# EasyEDA Pro project 氢气传感器（已标定模块）.eprj

# Schematic Schematic1

## Sheets
1 P1: Board Name: Board1; Create Date: 2025-02-25; Page Name: P1; Project Name: 氢气传感器（已标定模块）; Schematic Name: Schematic1; Update Date: 2025-02-26; Company: 嘉立创EDA; Page Size: A4; Version: V1.0
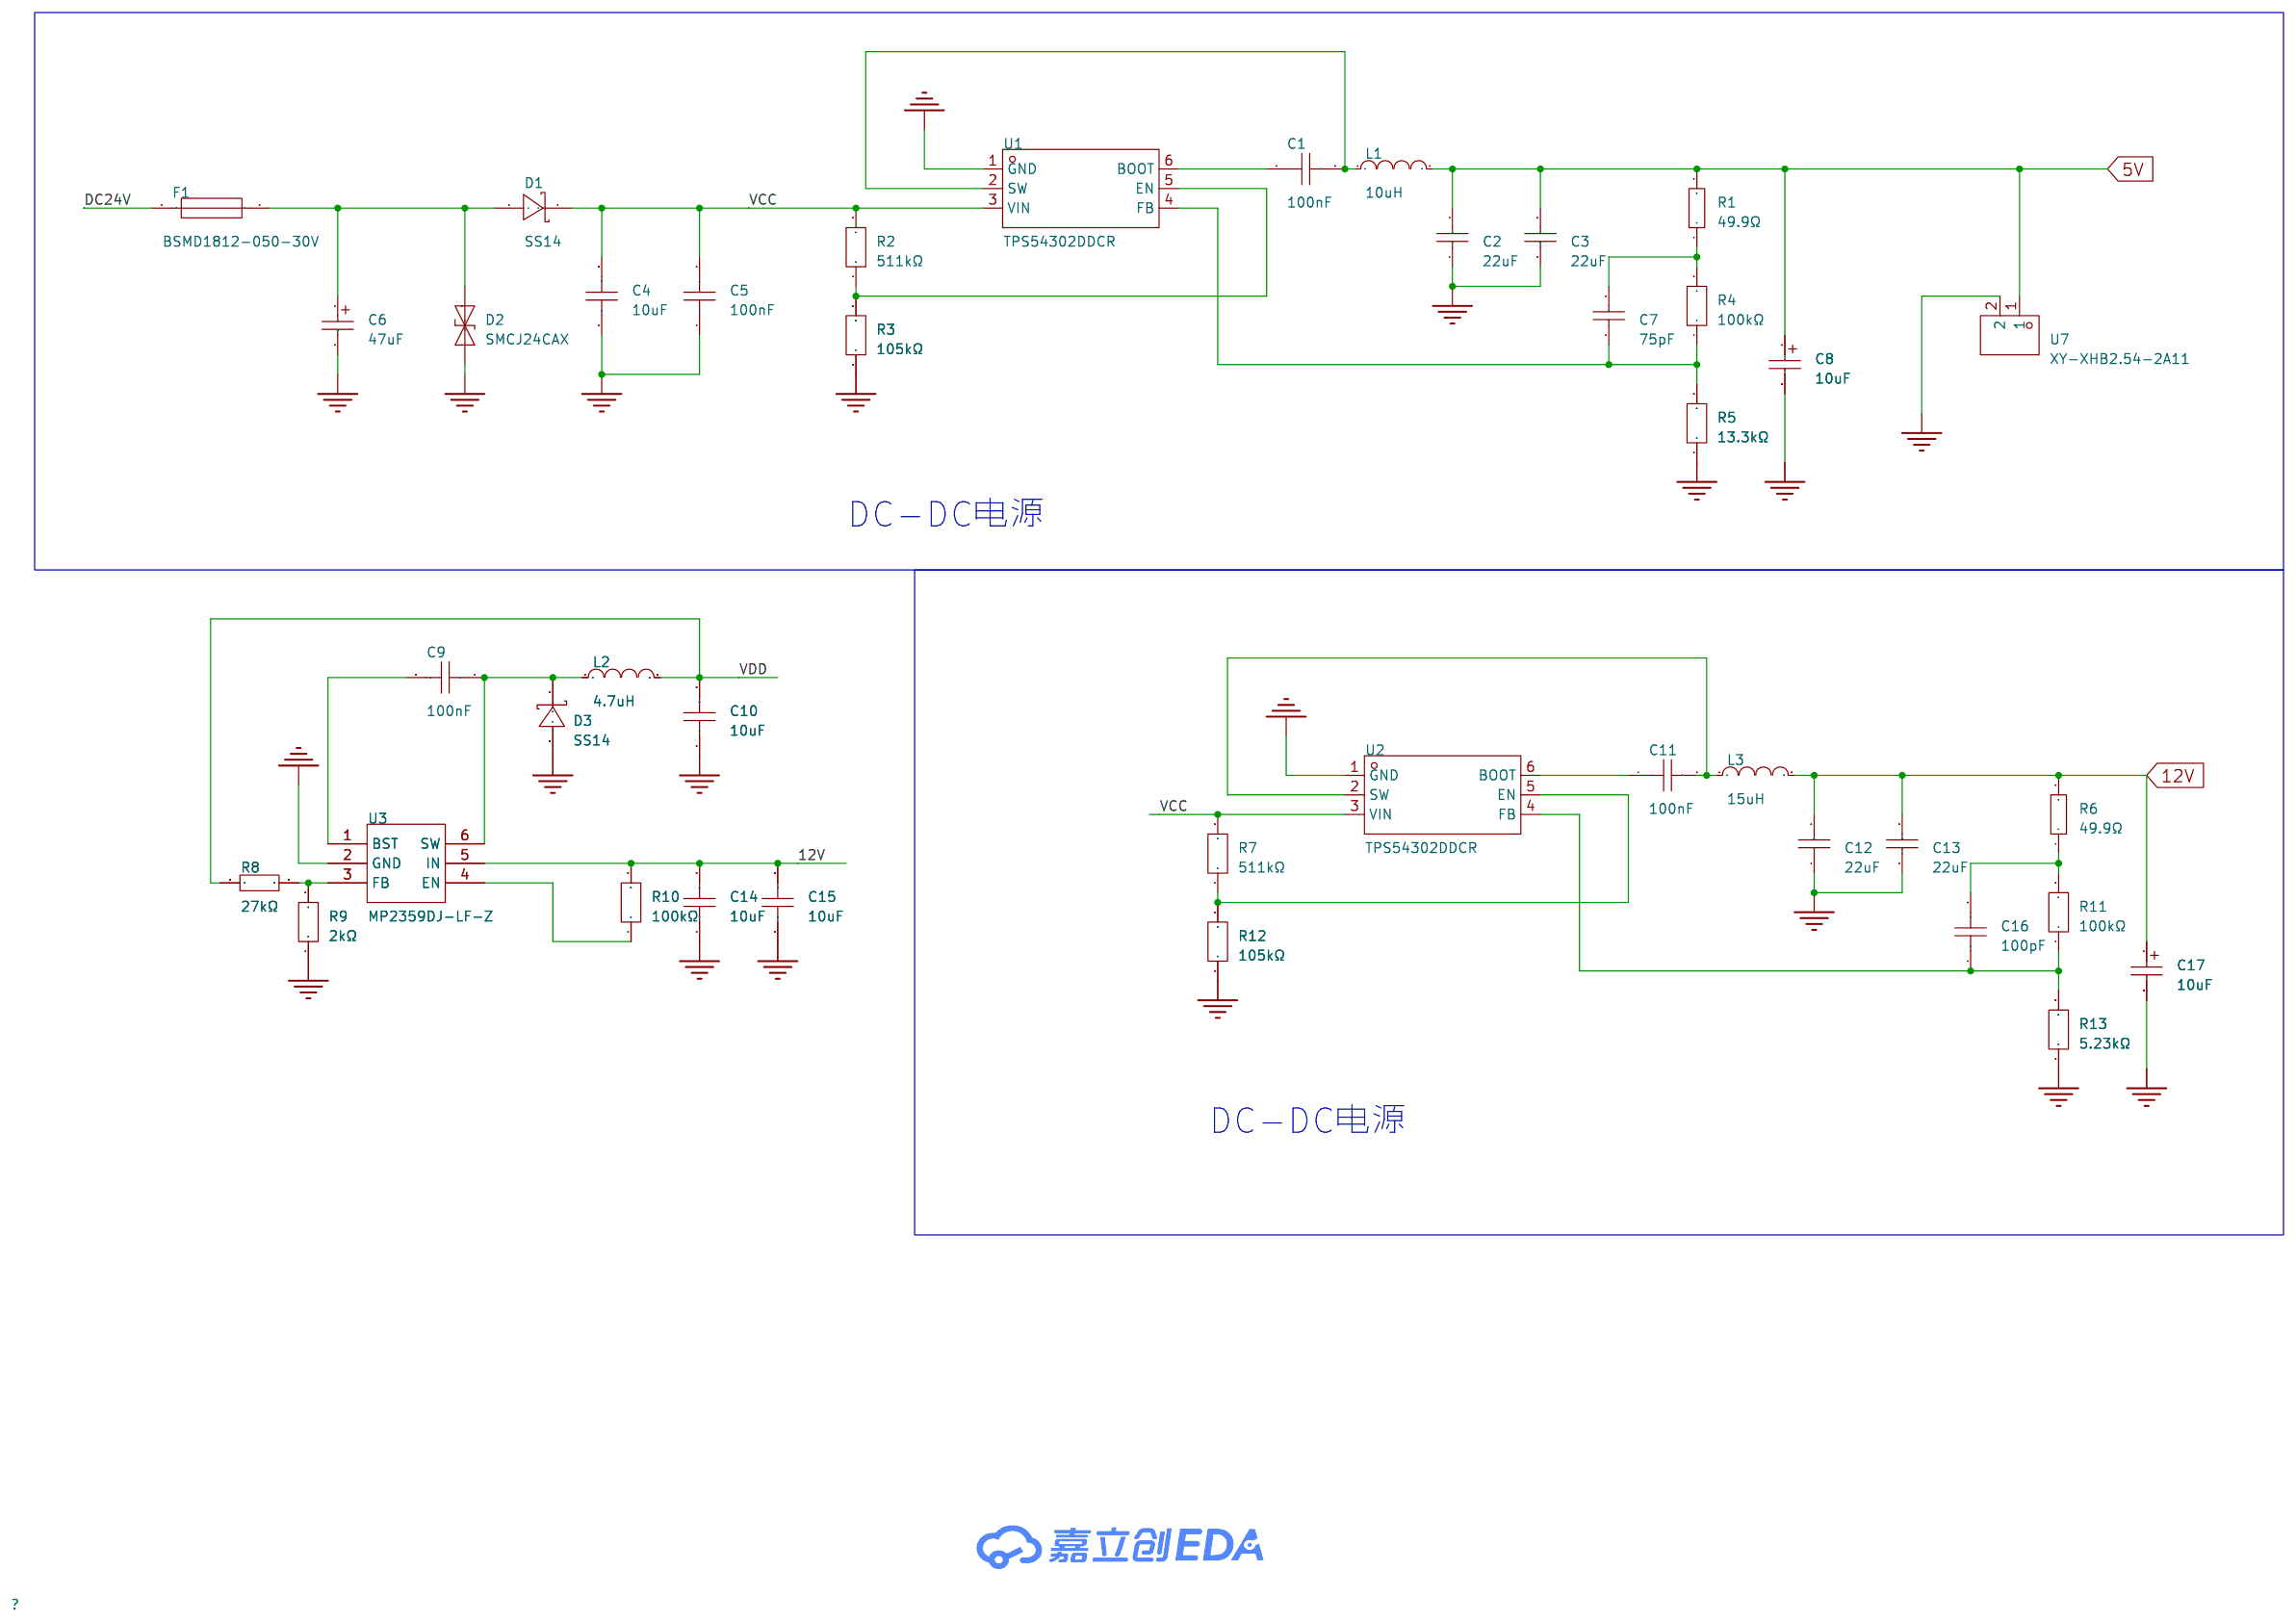
[diagram p0: P1]
2 P2: Page Name: P2; Update Date: 2025-02-27
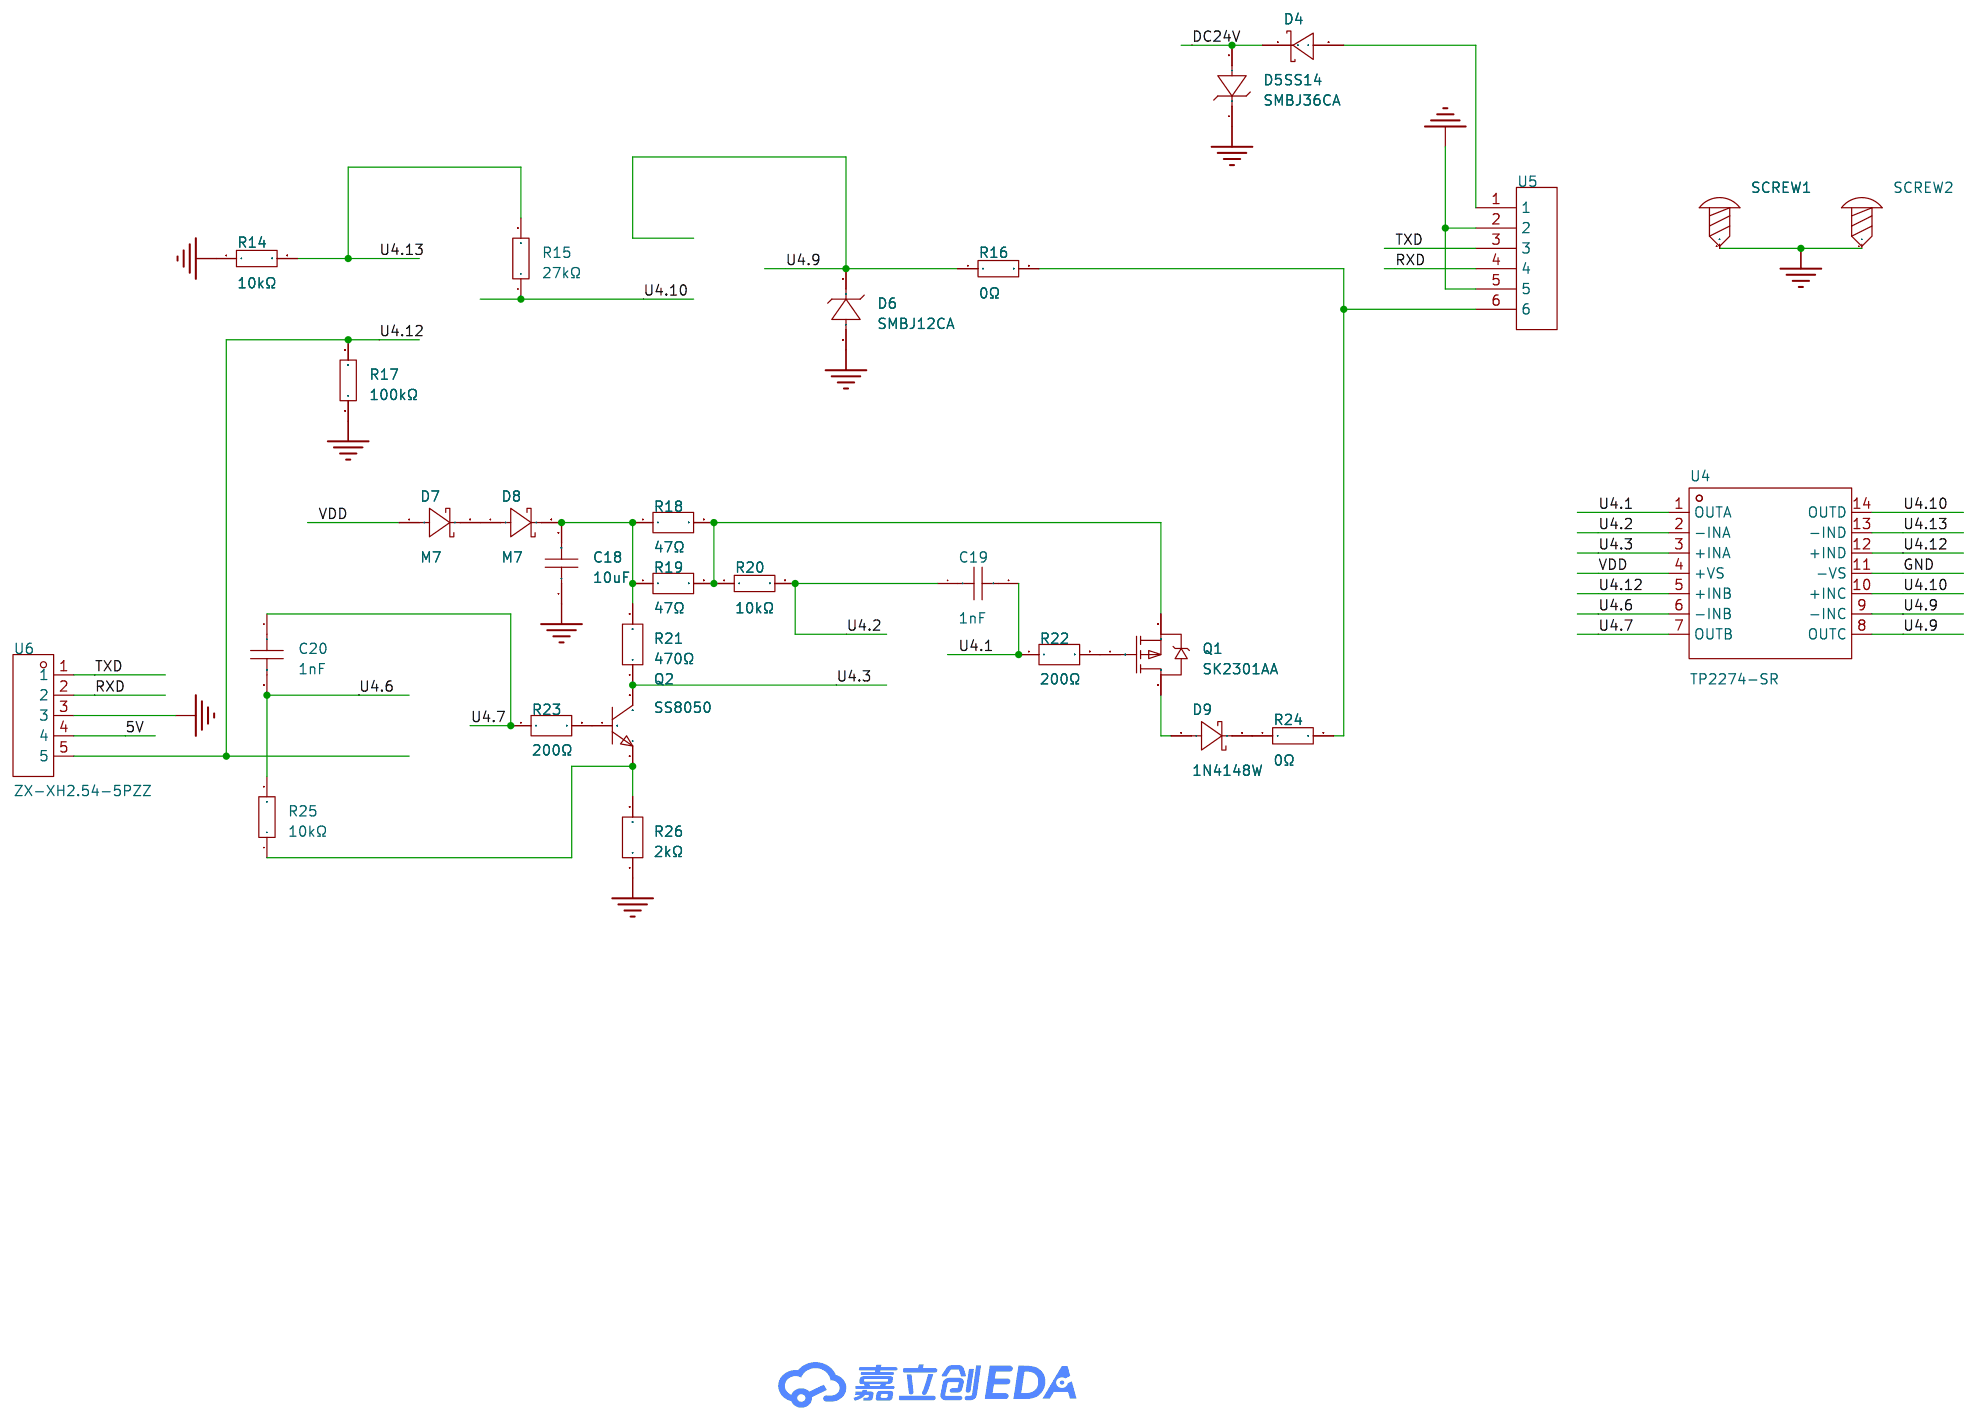
[diagram p1: P2]

## Parts
sheet P1
C1  100nF  [C0402]
C2  22uF  [C0805]
C3  22uF  [C0805]
C4  10uF  [C0603]
C5  100nF  [C0402]
C6  47uF  [CAP-SMD_L7.3-W4.3-FD]
C7  75pF  [C0402]
C8  10uF  [CASE-C_6032]
C9  100nF  [C0402]
C10  10uF  [C0603]
C11  100nF  [C0402]
C12  22uF  [C0805]
C13  22uF  [C0805]
C14  10uF  [C0603]
C15  10uF  [C0603]
C16  100pF  [C0402]
C17  10uF  [CASE-C_6032]
D1  SS14  [SMA_L4.2-W2.6-LS5.3-RD]
D2  SMCJ24CAX  [SMC_L6.9-W5.9-LS7.9-BI]
D3  SS14  [SMA_L4.3-W2.6-LS5.2-RD]
F1  BSMD1812-050-30V  [F1812]
L1  10uH  [IND-SMD_L4.4-W4.2]
L2  4.7uH  [IND-SMD_L7.0-W6.6]
L3  15uH  [IND-SMD_L4.0-W4.0]
R1  49.9Ω  [R0402]
R2  511kΩ  [R0603]
R3  105kΩ  [R0402]
R4  100kΩ  [R0402]
R5  13.3kΩ  [R0603]
R6  49.9Ω  [R0402]
R7  511kΩ  [R0603]
R8  27kΩ  [R0603]
R9  2kΩ  [R0603]
R10  100kΩ  [R0402]
R11  100kΩ  [R0402]
R12  105kΩ  [R0402]
R13  5.23kΩ  [R0603]
U1  TPS54302DDCR  [SOT-23-6_L2.9-W1.6-P0.95-LS2.8-BL]
U2  TPS54302DDCR  [SOT-23-6_L2.9-W1.6-P0.95-LS2.8-BL]
U3  MP2359DJ-LF-Z  [SOT-23-6_L2.9-W1.6-P0.95-LS2.8-BR]
U7  XY-XHB2.54-2A11  [HDR-TH_2P-P2.50-V-F-1]
sheet P2
C18  10uF  [C0603]
C19  1nF  [C0603]
C20  1nF  [C0603]
D4  SS14  [SMA_L4.3-W2.6-LS5.2-RD]
D5  SMBJ36CA  [SMB_L4.6-W3.6-LS5.4-RD]
D6  SMBJ12CA  [SMB_L4.6-W3.6-LS5.4-RD]
D7  M7  [SMA_L4.3-W2.6-LS5.0-FD]
D8  M7  [SMA_L4.3-W2.6-LS5.0-FD]
D9  1N4148W  [SOD-123_L2.7-W1.6-LS3.7-FD]
Q1  SK2301AA  [SOT-23-3_L2.9-W1.6-P1.90-LS2.8-BR]
Q2  SS8050  [SOT-23-3_L2.9-W1.3-P1.90-LS2.4-BR]
R14  10kΩ  [R0603]
R15  27kΩ  [R0603]
R16  0Ω  [R0603]
R17  100kΩ  [R0603]
R18  47Ω  [R0603]
R19  47Ω  [R0603]
R20  10kΩ  [R0603]
R21  470Ω  [R0603]
R22  200Ω  [R0603]
R23  200Ω  [R0603]
R24  0Ω  [R0603]
R25  10kΩ  [R0603]
R26  2kΩ  [R0603]
SCREW1  -  [M4螺丝]
SCREW2  -  [M4螺丝]
U4  TP2274-SR  [SOIC-14_L8.7-W3.9-P1.27-LS6.0-BL]
U5  -  [LC8+LZ8V-2.54 5PIN]
U6  ZX-XH2.54-5PZZ  [CONN-TH_5P-P2.50_ZX-XH2.54-5PZZ]

## Library data of the parts
C1 C5 C9 C11 = CC0402KRX7R9BB104: LCSC Part Name: 100nF ±10% 50V; Supplier Part: C131394; Manufacturer: YAGEO(国巨); Supplier Footprint: 0402; JLCPCB Part Class: Extended Part; Datasheet: https://atta.szlcsc.com/upload/public/pdf/source/20181008/C309510_22F155564471FAF6A489F7D68F34234E.pdf; Supplier: LCSC; Tolerance: ±10%; Voltage Rated: 50V; Temperature Coefficient: X7R
C2 C3 C12 C13 = CC0805MKX5R8BB226: 容值:22uF;精度:±20%;额定电压:25V;材质(温度系数):X5R;; LCSC Part Name: 22uF ±20% 25V; Supplier Part: C784585; Manufacturer: YAGEO(国巨); Supplier Footprint: 0805; JLCPCB Part Class: 扩展库; Datasheet: https://atta.szlcsc.com/upload/public/pdf/source/20200508/C527238_0EA038105174A9B3D7C24FF11EEA8EC7.pdf; Supplier: LCSC; Tolerance: ±20%; Voltage Rated: 25V; Temperature Coefficient: X5R
C4 C10 C14 C15 = GRM188R6YA106MA73D: 容值:10uF;精度:±20%;额定电压:35V;材质(温度系数):X5R;; LCSC Part Name: 10uF ±20% 35V; Supplier Part: C194427; Manufacturer: muRata(村田); Supplier Footprint: 0603; JLCPCB Part Class: Extended Part; Datasheet: https://atta.szlcsc.com/upload/public/pdf/source/20210128/C194427_FCA3640823207DDB58700A82F1A19B5F.pdf; Supplier: LCSC; Tolerance: ±20%; Voltage Rated: 35V; Temperature Coefficient: X5R
C6 = T491X476K035AT: 容值:47uF;精度:±10%;额定电压:35V;等效串联电阻:600mΩ@100kHz;; LCSC Part Name: 47uF ±10% 35V; Supplier Part: C87110; Manufacturer: KEMET(基美); Supplier Footprint: CASE-X-7343; JLCPCB Part Class: 扩展库; Datasheet: https://atta.szlcsc.com/upload/public/pdf/source/20190402/C118128_17DC26F5D7668F0165447CB640F1E367.pdf; Supplier: LCSC; Tolerance: ±10%; Rated Voltage: 35V; Equivalent Series Resistance(ESR): 600mΩ@100kHz; Operating Temperature: -55℃~+125℃
C7 = CC0402JRNPO9BN750: 容值:75pF;精度:±5%;额定电压:50V;材质(温度系数):NP0;; LCSC Part Name: 75pF ±5% 50V; Supplier Part: C107010; Manufacturer: YAGEO(国巨); Supplier Footprint: 0402; JLCPCB Part Class: Extended Part; Datasheet: https://atta.szlcsc.com/upload/public/pdf/source/20170914/C128857_1505359892143968080.pdf; Supplier: LCSC; Tolerance: ±5%; Voltage Rated: 50V; Temperature Coefficient: NP0
C8 C17 = TAJC106K035RNJ: 容值:10uF;精度:±10%;额定电压:35V;等效串联电阻:1.6Ω@100kHz;; LCSC Part Name: 10uF ±10% 35V; Supplier Part: C7211; Manufacturer: Kyocera AVX; Supplier Footprint: CASE-C-6032; JLCPCB Part Class: 扩展库; Datasheet: https://atta.szlcsc.com/upload/public/pdf/source/20160107/1457707750344.pdf; Supplier: LCSC; Tolerance: ±10%; Rated Voltage: 35V; Equivalent Series Resistance(ESR): 1.6Ω@100kHz; Operating Temperature: -55℃~+125℃
C16 = CC0402KRX7R8BB101: 容值:100pF;精度:±10%;额定电压:25V;材质(温度系数):X7R;; LCSC Part Name: 100pF ±10% 25V; Supplier Part: C541383; Manufacturer: YAGEO(国巨); Supplier Footprint: 0402; JLCPCB Part Class: 扩展库; Datasheet: https://atta.szlcsc.com/upload/public/pdf/source/20200615/C541383_DECF9DA0F3ABF65B608AAC96DDEE57A4.pdf; Supplier: LCSC; Tolerance: ±10%; Voltage Rated: 25V; Temperature Coefficient: X7R
D1 = SS14_C2480: 二极管配置:独立式;正向压降(Vf):550mV@1A;直流反向耐压(Vr):40V;整流电流:1A;; LCSC Part Name: 电压:40V 电流:1A; Supplier Part: C2480; Manufacturer: MDD(辰达半导体); Supplier Footprint: SMA(DO-214AC); JLCPCB Part Class: 基础库; Datasheet: https://atta.szlcsc.com/upload/public/pdf/source/20240710/EF24798823EE33D63F154ED67BAC5E71.pdf; Supplier: LCSC; Diode Configuration: 独立式; Forward Voltage (Vf@If): 550mV@1A; Reverse Voltage (Vr): 40V; Rectified Current: 1A; Reverse Leakage Current (Ir): 300uA@40V
D2 = SMCJ24CAX: VRWM24(V)/VBR(Min)@IT26.7(V)/VBR(Max)@IT30.7(V)/IT1(mA)/IR5(uA)/VC(Max)38.9(V)/Ipp(Max)38.6(A); LCSC Part Name: SMCJ24CA; Supplier Part: C3038088; Manufacturer: 晶扬电子; Supplier Footprint: SMC; JLCPCB Part Class: 扩展库; Datasheet: https://atta.szlcsc.com/upload/public/pdf/source/20220706/E11633D1F3056EEAC21E697B7AB2FD4F.pdf; Supplier: LCSC
D3 D4 = SS14_C83852: LCSC Part Name: 电压:40V 电流:1A; Supplier Part: C83852; Manufacturer: onsemi(安森美); Supplier Footprint: SMA(DO-214AC); JLCPCB Part Class: 扩展库; Datasheet: https://atta.szlcsc.com/upload/public/pdf/source/20181222/C83852_041FE29A925F1DAA7D9CB1F1C69076C2.pdf; Supplier: LCSC; Forward Voltage (Vf@If): 500mV@1A; Reverse Voltage (Vr): 40V; Rectified Current: 1A; Reverse Leakage Current (Ir): 200uA@40V
F1 = BSMD1812-050-30V: 最大电压:30V;最大电流:40A;保持电流:500mA;跳闸电流:1A;; LCSC Part Name: 30V 500mA 1812自恢复; Supplier Part: C883141; Manufacturer: BHFUSE(佰宏); Supplier Footprint: 1812; JLCPCB Part Class: 扩展库; Datasheet: https://atta.szlcsc.com/upload/public/pdf/source/20230512/6ED7FF50F668B3AF958C55F12246A840.pdf; Supplier: LCSC; Operating Voltage (Max): 30V; Current Rating (Max): 40A; Hold Current: 500mA; Trip Current: 1A; Power Dissipation: 800mW; Resistance - Initial (Ri) (Min): 150mΩ; Resistance - Post Trip (R1) (Max): 1.4Ω; Maximum Time to Trip: 150ms; Operating Temperature: -40℃~+85℃
L1 = FXL0420-100-M: 电感值:10uH;精度:±20%;额定电流:1.6A;饱和电流(Isat):2.2A;类型:一体成型电感;; LCSC Part Name: 10uH ±20% 2.2A; Supplier Part: C177242; Manufacturer: cjiang(长江微电); Supplier Footprint: SMD,4.2x4.4mm; JLCPCB Part Class: 扩展库; Datasheet: https://atta.szlcsc.com/upload/public/pdf/source/20240426/3189EA8206330E2108542F9E34E540E7.pdf; Supplier: LCSC; Tolerance: ±20%; Rated Current: 1.6A; Saturation Current (Isat): 2.2A; DC Resistance (DCR): 282mΩ; Type: 一体成型电感
L2 = FXL0630-4R7-M: LCSC Part Name: 4.7uH ±20% 9A; Supplier Part: C167220; Manufacturer: cjiang(长江微电); Supplier Footprint: SMD,6.6x7mm; JLCPCB Part Class: 扩展库; Datasheet: https://atta.szlcsc.com/upload/public/pdf/source/20240426/3189EA8206330E2108542F9E34E540E7.pdf; Supplier: LCSC; Tolerance: ±20%; Rated Current: 6A; Saturation Current (Isat): 9A; DC Resistance (DCR): 33mΩ; Type: 一体成型电感
L3 = FHD4020S-150MT: 电感值:15uH;精度:±20%;额定电流:1.2A;饱和电流(Isat):2.8A;; LCSC Part Name: 15uH ±20% 2.8A; Supplier Part: C602033; Manufacturer: cjiang(长江微电); Supplier Footprint: SMD,4x4mm; JLCPCB Part Class: 扩展库; Datasheet: https://atta.szlcsc.com/upload/public/pdf/source/20200609/C601990_BCEA243EC4DA0A9A288AA78A6DFB48A5.pdf; Supplier: LCSC; Tolerance: ±20%; Rated Current: 1.2A; Saturation Current (Isat): 2.8A; DC Resistance (DCR): 305mΩ
R1 R6 = PTFR0402B49R9P9: 电阻类型:薄膜电阻;阻值:49.9Ω;精度:±0.1%;功率:60mW;最大工作电压:75V;温度系数:±25ppm/℃;; LCSC Part Name: 薄膜电阻 49.9Ω ±0.1% 60mW; Supplier Part: C478876; Manufacturer: RESI(开步睿思); Supplier Footprint: 0402; JLCPCB Part Class: Extended Part; Datasheet: https://atta.szlcsc.com/upload/public/pdf/source/20240506/11BDC7478D84177AC2A5326A65B6EB29.pdf; Supplier: LCSC; Type: 薄膜电阻; Tolerance: ±0.1%; Power(Watts): 60mW; Overload Voltage (Max): 75V; Temperature Coefficient: ±25ppm/℃; Operating Temperature Range: -55℃~+125℃
R2 R7 = ARG03BTC5113: 电阻类型:薄膜电阻;阻值:511kΩ;精度:±0.1%;功率:100mW;最大工作电压:75V;温度系数:±25ppm/℃;; LCSC Part Name: 薄膜电阻 511kΩ ±0.1% 100mW; Supplier Part: C2684557; Manufacturer: Viking(光颉); Supplier Footprint: 0603; JLCPCB Part Class: Extended Part; Datasheet: https://atta.szlcsc.com/upload/public/pdf/source/20200117/C485675_99063924B4564AF910B7BE66DA8EFA49.pdf; Supplier: LCSC; Type: 薄膜电阻; Tolerance: ±0.1%; Power(Watts): 100mW; Overload Voltage (Max): 75V; Temperature Coefficient: ±25ppm/℃; Operating Temperature Range: -55℃~+155℃
R3 R12 = RT0402BRD07105KL: 电阻类型:薄膜电阻;阻值:105kΩ;精度:±0.1%;功率:62.5mW;温度系数:±25ppm/℃;; LCSC Part Name: 薄膜电阻 105kΩ ±0.1% 62.5mW; Supplier Part: C852475; Manufacturer: YAGEO(国巨); Supplier Footprint: 0402; JLCPCB Part Class: Extended Part; Datasheet: https://atta.szlcsc.com/upload/public/pdf/source/20200610/C326738_5639A9F1B6EB6E4AE2197577D3456E7F.pdf; Supplier: LCSC; Type: 薄膜电阻; Tolerance: ±0.1%; Power(Watts): 62.5mW; Temperature Coefficient: ±25ppm/℃; Operating Temperature Range: -55℃~+155℃
R4 R10 R11 = RT0402BRD07100KL: 电阻类型:薄膜电阻;阻值:100kΩ;精度:±0.1%;功率:62.5mW;最大工作电压:50V;温度系数:±25ppm/℃;; LCSC Part Name: 薄膜电阻 100kΩ ±0.1% 62.5mW; Supplier Part: C852472; Manufacturer: YAGEO(国巨); Supplier Footprint: 0402; JLCPCB Part Class: 扩展库; Datasheet: https://atta.szlcsc.com/upload/public/pdf/source/20210326/C852472_6283D268A9C33EA67274729CC55E28B1.pdf; Supplier: LCSC; Type: 薄膜电阻; Tolerance: ±0.1%; Power(Watts): 62.5mW; Overload Voltage (Max): 50V; Temperature Coefficient: ±25ppm/℃; Operating Temperature Range: -55℃~+155℃
R5 = RT0603BRD0713K3L: 电阻类型:薄膜电阻;阻值:13.3kΩ;精度:±0.1%;功率:100mW;最大工作电压:75V;温度系数:±25ppm/℃;; LCSC Part Name: 薄膜电阻 13.3kΩ ±0.1% 100mW; Supplier Part: C861117; Manufacturer: YAGEO(国巨); Supplier Footprint: 0603; JLCPCB Part Class: Extended Part; Datasheet: https://atta.szlcsc.com/upload/public/pdf/source/20200610/C326738_5639A9F1B6EB6E4AE2197577D3456E7F.pdf; Supplier: LCSC; Type: 薄膜电阻; Tolerance: ±0.1%; Power(Watts): 100mW; Overload Voltage (Max): 75V; Temperature Coefficient: ±25ppm/℃; Operating Temperature Range: -55℃~+155℃
R8 R15 = RT0603BRE0727KL: LCSC Part Name: 薄膜电阻 27kΩ ±0.1% 100mW; Supplier Part: C326751; Manufacturer: YAGEO(国巨); Supplier Footprint: 0603; JLCPCB Part Class: Extended Part; Datasheet: https://atta.szlcsc.com/upload/public/pdf/source/20181031/C326751_F0C7ED3CCC78679E2CE8C1AED7A94608.pdf; Supplier: LCSC; Type: 薄膜电阻; Tolerance: ±0.1%; Power(Watts): 100mW; Overload Voltage (Max): 75V; Temperature Coefficient: ±50ppm/℃; Operating Temperature Range: -55℃~+155℃
R9 R26 = RT0603BRD072KL: LCSC Part Name: 薄膜电阻 2kΩ ±0.1% 100mW; Supplier Part: C728588; Manufacturer: YAGEO(国巨); Supplier Footprint: 0603; JLCPCB Part Class: Extended Part; Datasheet: https://atta.szlcsc.com/upload/public/pdf/source/20200814/C723483_9C38DBFE9BAEFED0FBB9716EAA9FF07C.pdf; Supplier: LCSC; Type: 薄膜电阻; Tolerance: ±0.1%; Power(Watts): 100mW; Temperature Coefficient: ±25ppm/℃; Operating Temperature Range: -55℃~+155℃
R13 = RT0603BRD075K23L: 电阻类型:薄膜电阻;阻值:5.23kΩ;精度:±0.1%;功率:100mW;温度系数:±25ppm/℃;; LCSC Part Name: 薄膜电阻 5.23kΩ ±0.1% 100mW; Supplier Part: C861485; Manufacturer: YAGEO(国巨); Supplier Footprint: 0603; JLCPCB Part Class: Extended Part; Datasheet: https://atta.szlcsc.com/upload/public/pdf/source/20200610/C326738_5639A9F1B6EB6E4AE2197577D3456E7F.pdf; Supplier: LCSC; Type: 薄膜电阻; Tolerance: ±0.1%; Power(Watts): 100mW; Temperature Coefficient: ±25ppm/℃; Operating Temperature Range: -55℃~+155℃
U1 U2 = TPS54302DDCR: 功能类型:降压型;输出类型:固定;工作电压:4.5V~28V;输出电压:5V;输出电流:3A;; LCSC Part Name: 4.5V至28V输入、3A输出、EMI友好的同步降压转换器; Supplier Part: C311983; Manufacturer: TI(德州仪器); Supplier Footprint: TSOT-23-6; JLCPCB Part Class: 扩展库; Datasheet: https://www.ti.com/cn/lit/gpn/tps54302; Supplier: LCSC; Function: 降压型; Output Type: 固定; Input Voltage: 4.5V~28V; Output Voltage: 5V; Output Current: 3A; Switching Frequency: 400kHz; Operating Temperature: -40℃~+125℃; Synchronous Rectification: 是; Number of Outputs: 1; Topology: 降压式; Quiescent Current (Iq): 45uA; Switch tube (built-in/external): 内置
U3 = MP2359DJ-LF-Z: Supplier Part: C14259; Manufacturer: MPS(芯源); Supplier Footprint: TSOT-23-6; JLCPCB Part Class: 扩展库; Datasheet: https://atta.szlcsc.com/upload/public/pdf/source/20240129/21CBBF6F83E2E7F822A0D20325A1F6D1.pdf; Supplier: LCSC; Function: 降压型; Output Type: 可调; Input Voltage: 4.5V~24V; Output Voltage: 810mV~15V; Output Current: 1.2A; Switching Frequency: 1.4MHz; Operating Temperature: -40℃~+85℃@(TA); Synchronous Rectification: 否; Number of Outputs: 1; Topology: 降压式; Switch tube (built-in/external): 内置
U7 = XY-XHB2.54-2A11: LCSC Part Name: 1x2P 间距:2.54mm 直插; Supplier Part: C19271386; Manufacturer: XYECONN(辛译); Supplier Footprint: 插件,P=2.54mm; JLCPCB Part Class: 扩展库; Datasheet: https://atta.szlcsc.com/upload/public/pdf/source/20231124/C902967B562345BA8733710E2DCD4DF9.pdf; Supplier: LCSC; Pins Structure: 1x2P; Pitch: 2.54mm; Mounting Style: 直插; Number of Pins: 2P; Number of Rows: 1; Number of PINs Per Row: 2; Row Spacing: 2.54mm; Current Rating (Max): 2A; Operating Temperature Range: -25℃~+85℃
C18 = HGC0603R5106M350NTHJ: LCSC Part Name: 10uF ±20% 35V; Supplier Part: C22367827; Manufacturer: Chinocera(华瓷); Supplier Footprint: 0603; JLCPCB Part Class: 扩展库; Datasheet: https://atta.szlcsc.com/upload/public/pdf/source/20240326/08136F0414FFF46DD07E47F2D66E675E.pdf; Supplier: LCSC; Tolerance: ±20%; Voltage Rated: 35V; Temperature Coefficient: X5R
C19 C20 = CC0603KRX7R9BB102: LCSC Part Name: 1nF ±10% 50V; Supplier Part: C100040; Manufacturer: YAGEO(国巨); Supplier Footprint: 0603; JLCPCB Part Class: Extended Part; Datasheet: https://atta.szlcsc.com/upload/public/pdf/source/20180910/C282072_33301C7F631E79921B82A8DAC6BCC5B3.pdf; Supplier: LCSC; Tolerance: ±10%; Voltage Rated: 50V; Temperature Coefficient: X7R
D5 = SMBJ36CA_C19077589: Supplier Part: C19077589; Manufacturer: 宏嘉诚; Supplier Footprint: SMB; JLCPCB Part Class: Extended Part; Datasheet: https://atta.szlcsc.com/upload/public/pdf/source/20250107/474F05451FC8AB27D7FA0238914F96F6.pdf; Supplier: LCSC; Polarity: 双向; Reverse Stand-Off Voltage (Vrwm): 36V; Clamping Voltage: 58.1V; Peak Pulse Current (Ipp): 10.33A; Peak Pulse Power Dissipation (Ppp): 600W; Voltage - Breakdown: 40V; Reverse Leakage Current (Ir): 5uA; Number of Channels: 单路; Type: TVS
D6 = SMBJ12CA_C19077566: Supplier Part: C19077566; Manufacturer: 宏迦橙; Supplier Footprint: SMB; JLCPCB Part Class: Extended Part; Datasheet: https://atta.szlcsc.com/upload/public/pdf/source/20240521/70EB82B9CFA2B663C3BC6584026036D0.pdf; Supplier: LCSC; polarity: 双向; Reverse Stand-Off Voltage (Vrwm): 12V; Maximum Clamping Voltage: 19.9V; Peak Pulse Current (Ipp)@10/1000us: 30.15A; Peak Pulse Power Dissipation (Ppp)@10/1000us: 600W; Breakdown Voltage: 13.3V; Reverse Leakage Current (Ir): 5uA; Number of Lines: 单路; Operating Temperature: -55℃~+155℃; Type: TVS
D7 D8 = M7_C7420350: Supplier Part: C7420350; Manufacturer: 宏迦橙; Supplier Footprint: SMA(DO-214AC); JLCPCB Part Class: 扩展库; Datasheet: https://atta.szlcsc.com/upload/public/pdf/source/20230828/CA59226B69C4023C11E82B13108B998C.pdf; Supplier: LCSC; Diode Configuration: 独立式; Forward Voltage (Vf@If): 1.1V@1A; Reverse Voltage (Vr): 1kV; Rectified Current: 1A; Reverse Leakage Current (Ir): 5uA@1000V
D9 = 1N4148W_C7420318: Supplier Part: C7420318; Manufacturer: 宏迦橙; Supplier Footprint: SOD-123; JLCPCB Part Class: 扩展库; Datasheet: https://atta.szlcsc.com/upload/public/pdf/source/20230828/E5C3F7A4272052930A7E03B75759BF50.pdf; Supplier: LCSC; Diode Configuration: 独立式; Forward Voltage (Vf@If): 1.25V@150mA; Reverse Voltage (Vr): 100V; Rectified Current: 150mA; Reverse Leakage Current (Ir): 1uA@75V; Reverse Recovery Time (trr): 4ns; Operating Temperature: -55℃~+150℃
Q1 = SK2301AA: LCSC Part Name: P沟道 耐压:16V 电流:3A; Supplier Part: C118316; Manufacturer: SHIKUES(时科); Supplier Footprint: SOT-23; JLCPCB Part Class: 扩展库; Datasheet: https://atta.szlcsc.com/upload/public/pdf/source/20170722/1500687322978.pdf; Supplier: LCSC; Type: P沟道; Drain Source Voltage (Vdss): 16V; Continuous Drain Current (Id): 3A; Drain Source On Resistance (RDS(on)@Vgs,Id): 160mΩ@4.5V,3A; Gate Threshold Voltage (Vgs(th)@Id): 1.5V@250uA
Q2 = SS8050_C7420370: LCSC Part Name: 耐压:25V 电流:1.5A NPN H档 200-350; Supplier Part: C7420370; Manufacturer: 宏迦橙; Supplier Footprint: SOT-23; JLCPCB Part Class: 扩展库; Datasheet: https://atta.szlcsc.com/upload/public/pdf/source/20231222/9C4050A7669EB24B3ACD0418218817FD.pdf; Supplier: LCSC; Transistor Type: NPN; Collector Current (Ic): 1.5A; Collector-Emitter Breakdown Voltage (Vceo): 25V; Power Dissipation (Pd): 300mW; DC Current Gain (hFE@Ic,Vce): 120@100mA,1.0V; Transition Frequency (fT): 100MHz; Collector Cut-Off Current (Icbo): 100nA; Collector-Emitter Saturation Voltage (VCE(sat)@Ic,Ib): 500mV@800mA,80mA; Operating Temperature: -55℃~+150℃
R14 R20 R25 = RT0603BRD0710KL: LCSC Part Name: 薄膜电阻 10kΩ ±0.1% 100mW; Supplier Part: C95204; Manufacturer: YAGEO(国巨); Supplier Footprint: 0603; JLCPCB Part Class: Extended Part; Datasheet: https://atta.szlcsc.com/upload/public/pdf/source/20170217/1487301593756.pdf; Supplier: LCSC; Type: 薄膜电阻; Tolerance: ±0.1%; Power(Watts): 100mW; Overload Voltage (Max): 75V; Temperature Coefficient: ±25ppm/℃; Operating Temperature Range: -55℃~+155℃
R16 R24 = RC0603FR-070RL: LCSC Part Name: 厚膜电阻 0Ω ±1% 100mW; Supplier Part: C100044; Manufacturer: YAGEO(国巨); Supplier Footprint: 0603; JLCPCB Part Class: Extended Part; Datasheet: https://atta.szlcsc.com/upload/public/pdf/source/20180316/70C0E2BDAE7FCC62C531A5A58D202EE1.pdf; Supplier: LCSC; Type: 厚膜电阻; Tolerance: ±1%; Power(Watts): 100mW; Overload Voltage (Max): 75V; Operating Temperature Range: -55℃~+155℃
R17 = RT0603BRD07100KL: LCSC Part Name: 薄膜电阻 100kΩ ±0.1% 100mW; Supplier Part: C122538; Manufacturer: YAGEO(国巨); Supplier Footprint: 0603; JLCPCB Part Class: 扩展库; Datasheet: https://atta.szlcsc.com/upload/public/pdf/source/20170721/C122538_1500619326323834092.pdf; Supplier: LCSC; Type: 薄膜电阻; Tolerance: ±0.1%; Power(Watts): 100mW; Overload Voltage (Max): 75V; Temperature Coefficient: ±25ppm/℃; Operating Temperature Range: -55℃~+155℃
R18 R19 = RT0603BRE0747RL: LCSC Part Name: 薄膜电阻 47Ω ±0.1% 100mW; Supplier Part: C705861; Manufacturer: YAGEO(国巨); Supplier Footprint: 0603; JLCPCB Part Class: Extended Part; Datasheet: https://atta.szlcsc.com/upload/public/pdf/source/20200720/C705861_38135A8C7AA70109CA13E06D71556DDE.pdf; Supplier: LCSC; Type: 薄膜电阻; Tolerance: ±0.1%; Power(Watts): 100mW; Overload Voltage (Max): 75V; Temperature Coefficient: ±50ppm/℃; Operating Temperature Range: -55℃~+155℃
R21 = AR03BTC4700: LCSC Part Name: 470Ω ±0.1% 62.5mW; Supplier Part: C374403; Manufacturer: Viking(光颉); Supplier Footprint: 0603; JLCPCB Part Class: Extended Part; Datasheet: https://atta.szlcsc.com/upload/public/pdf/source/20191129/C465721_10D49275DB41E427863CE9C8D788770A.pdf; Supplier: LCSC; Tolerance: ±0.1%; Power(Watts): 62.5mW; Temperature Coefficient: ±25ppm/℃
R22 R23 = RT0603BRD07200RL: LCSC Part Name: 薄膜电阻 200Ω ±0.1% 100mW; Supplier Part: C861216; Manufacturer: YAGEO(国巨); Supplier Footprint: 0603; JLCPCB Part Class: Extended Part; Datasheet: https://atta.szlcsc.com/upload/public/pdf/source/20181009/C309664_C7CEF5A7F4D0541F96EF5E54D941D229.pdf; Supplier: LCSC; Type: 薄膜电阻; Tolerance: ±0.1%; Power(Watts): 100mW; Overload Voltage (Max): 75V; Temperature Coefficient: ±25ppm/℃; Operating Temperature Range: -55℃~+155℃
SCREW1 SCREW2 = M4螺丝: Supplier Footprint: 插件
U4 = TP2274-SR: Supplier Part: C95870; Manufacturer: 3PEAK; Supplier Footprint: SOIC-14; JLCPCB Part Class: 扩展库; Datasheet: https://atta.szlcsc.com/upload/public/pdf/source/20170227/1488160676858.pdf; Supplier: LCSC; Number of Circuits: 四路; Gain Bandwidth Product(GBP): 7MHz; Slew Rate(SR): 20V/us; Supply Current: 900uA
U5 = LZ8V-2.54-6P: 2.54节距PCB插拔连接器_P6IN_联捷
U6 = ZX-XH2.54-5PZZ: LCSC Part Name: 1x5P 间距:2.5mm 直插 系列:XH; Supplier Part: C7429635; Manufacturer: Megastar(兆星); Supplier Footprint: 插件,P=2.5mm; JLCPCB Part Class: 扩展库; Datasheet: https://atta.szlcsc.com/upload/public/pdf/source/20230619/60EEF4ADD558E90BFFACF5D939816781.pdf; Supplier: LCSC; Pins Structure: 1x5P; Pitch: 2.5mm; Mounting Type: 直插; Reference Series: XH; Number of Pins: 5P; Number of Rows: 1; Number of PINs Per Row: 5; Rated Current: 3A; Contact Material: 黄铜; Contact Plating: 锡; Operating Temperature: -25℃~+85℃; Rated Voltage (Max): 250V; Plastic Material: PA66; Flame Retardant Rating: UL94V-0; Color: 白色; Z-Height of the Board: 7mm; X-Length of Bottom Edge on Board (Spacing Line): 15mm; Y-Width of Bottom Edge on Board: 5.9mm

## Nets
5V: C2.2 C3.2 C8.1 L1.2 R1.2 U6.4 U7.1
12V: C12.2 C13.2 C14.2 C15.2 C17.1 L3.2 R6.2 R10.2 U3.5(IN)
GND: C2.1 C3.1 C4.1 C5.1 C6.2 C8.2 C10.1 C12.1 C13.1 C14.1 C15.1 C17.2 C18.1 D2.1(K) D3.2(A) D5.1(K) D6.2(A) R3.1 R5.1 R9.1 R12.1 R13.1 R14.1 R17.1 R26.1 SCREW1.1 SCREW2.1 U1.1(GND) U2.1(GND) U3.2(GND) U4.11(-VS) U5.2 U5.5 U6.3 U7.2
VCC: C4.2 C5.2 D1.1(K) R2.2 R7.2 U1.3(VIN) U2.3(VIN)
VDD: C10.2 D7.1(A) L2.2 R8.1 U4.4(+VS)
DC24V: D4.1(K) D5.2(A) F1.1
RXD: U5.4 U6.2
TXD: U5.3 U6.1
U4.1: C19.2 R22.1 U4.1(OUTA)
U4.2: C19.1 R20.2 U4.2(-INA)
U4.3: Q2.3(C) R21.1 U4.3(+INA)
U4.6: C20.2 R25.2 U4.6(-INB)
U4.7: C20.1 R23.1 U4.7(OUTB)
U4.9: D6.1(K) R16.1 U4.8(OUTC) U4.9(-INC)
U4.10: R15.1 U4.10(+INC) U4.14(OUTD)
U4.12: R17.2 U4.5(+INB) U4.12(+IND) U6.5
U4.13: R14.2 R15.2 U4.13(-IND)
$1N943: C6.1 D1.2(A) D2.2(A) F1.2
$1N949: R2.1 R3.2 U1.5(EN)
$1N950: C1.1 U1.6(BOOT)
$1N951: C1.2 L1.1 U1.2(SW)
$1N954: C7.2 R1.1 R4.2
$1N955: C7.1 R4.1 R5.2 U1.4(FB)
$1N1502: R7.1 R12.2 U2.5(EN)
$1N1503: C11.1 U2.6(BOOT)
$1N1504: C11.2 L3.1 U2.2(SW)
$1N1507: C16.2 R6.1 R11.2
$1N1508: C16.1 R11.1 R13.2 U2.4(FB)
$1N1920: C9.1 D3.1(K) L2.1 U3.6(SW)
$1N2087: R10.1 U3.4(EN)
$1N2108: C9.2 U3.1(BST)
$1N2261: R8.2 R9.2 U3.3(FB)
$2N857: Q2.1(B) R23.2
$2N979: C18.2 D8.2(K) R18.1 R19.1 R21.2
$2N983: Q1.2(S) R18.2 R19.2 R20.1
$2N1088: D7.2(K) D8.1(A)
$2N1306: Q2.2(E) R25.1 R26.2
$2N1462: Q1.1(G) R22.2
$2N1508: D9.1(A) Q1.3(D)
$2N2130: D9.2(K) R24.1
$2N2230: D4.2(A) U5.1
$2N2492: R16.2 R24.2 U5.6

## Notes on the sheets
sheet 1
- DC-DC电源
- DC-DC电源

# Schematic Schematic2
Board Name: Board2; Create Date: 2025-04-14; Page Name: P1; Project Name: 氢气传感器（已标定模块）; Schematic Name: Schematic2; Update Date: 2025-04-14; Company: 嘉立创EDA; Page Size: A4; Version: V1.0
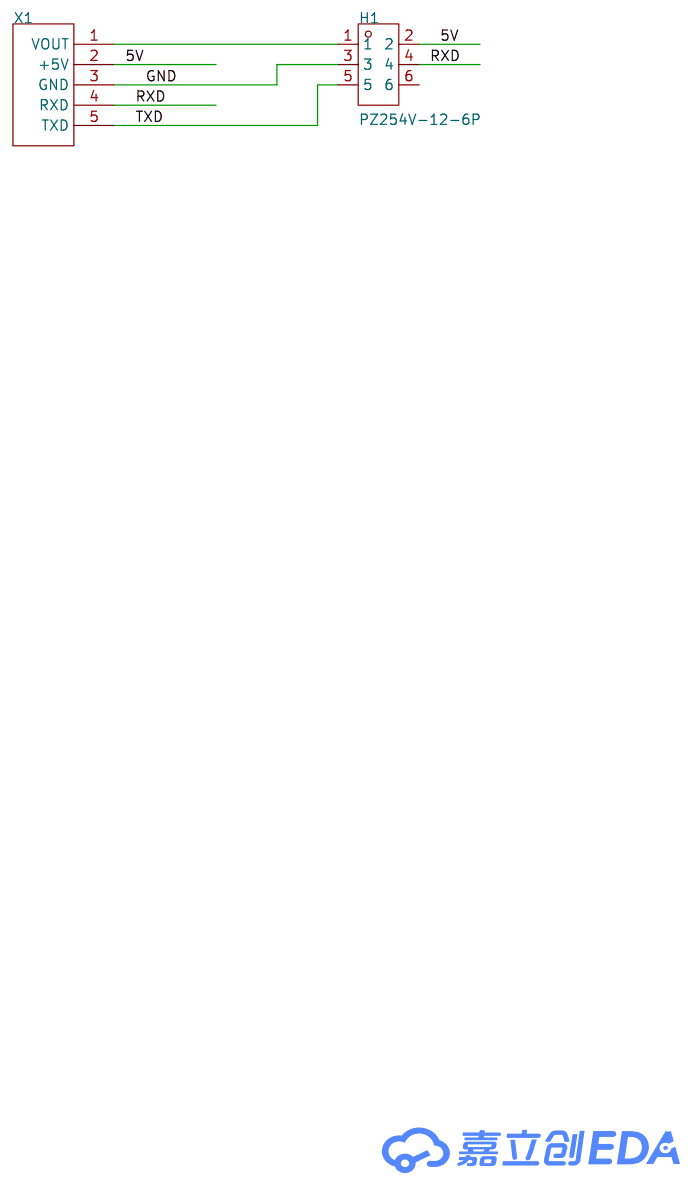
[diagram p2: schematic sheet]

## Parts
H1  PZ254V-12-6P  [HDR-TH_6P-P2.54-V-M-R2-C3-S2.54]
X1  -  [氢气传感器连接器]

## Library data of the parts
H1 = PZ254V-12-6P: LCSC Part Name: 间距:2.54mm 2x3P 直插 方针; Supplier Part: C492420; Manufacturer: XFCN(兴飞); Supplier Footprint: 插件,P=2.54mm; JLCPCB Part Class: 扩展库; Datasheet: https://atta.szlcsc.com/upload/public/pdf/source/20200309/C492420_BAECB307B001054C09D200388220EAE6.pdf; Supplier: LCSC; Pin Structure: 2x3P; Pitch: 2.54mm; Row Spacing: 2.54mm; Circluar Pins/Square Pins: 方针; Mounting Type: 直插; Number of Rows: 双排; Number of Pins: 6P; Length of Mating Pin: 6mm; Insulation Height: 2.5mm; Length of End Connection Pin: 3mm; Contact Material: 黄铜; Operating Temperature Range: -40℃~+105℃; Color: 黑色
X1 = 氢气探头连接器

## Nets
5V: H1.2 X1.2(+5V)
GND: H1.3 X1.3(GND)
RXD: H1.4 X1.4(RXD)
TXD: H1.5 X1.5(TXD)
$1N305: H1.1 X1.1(VOUT)

Not connected (* = marked no-connect by the designer): H1 6

# Board PCB1
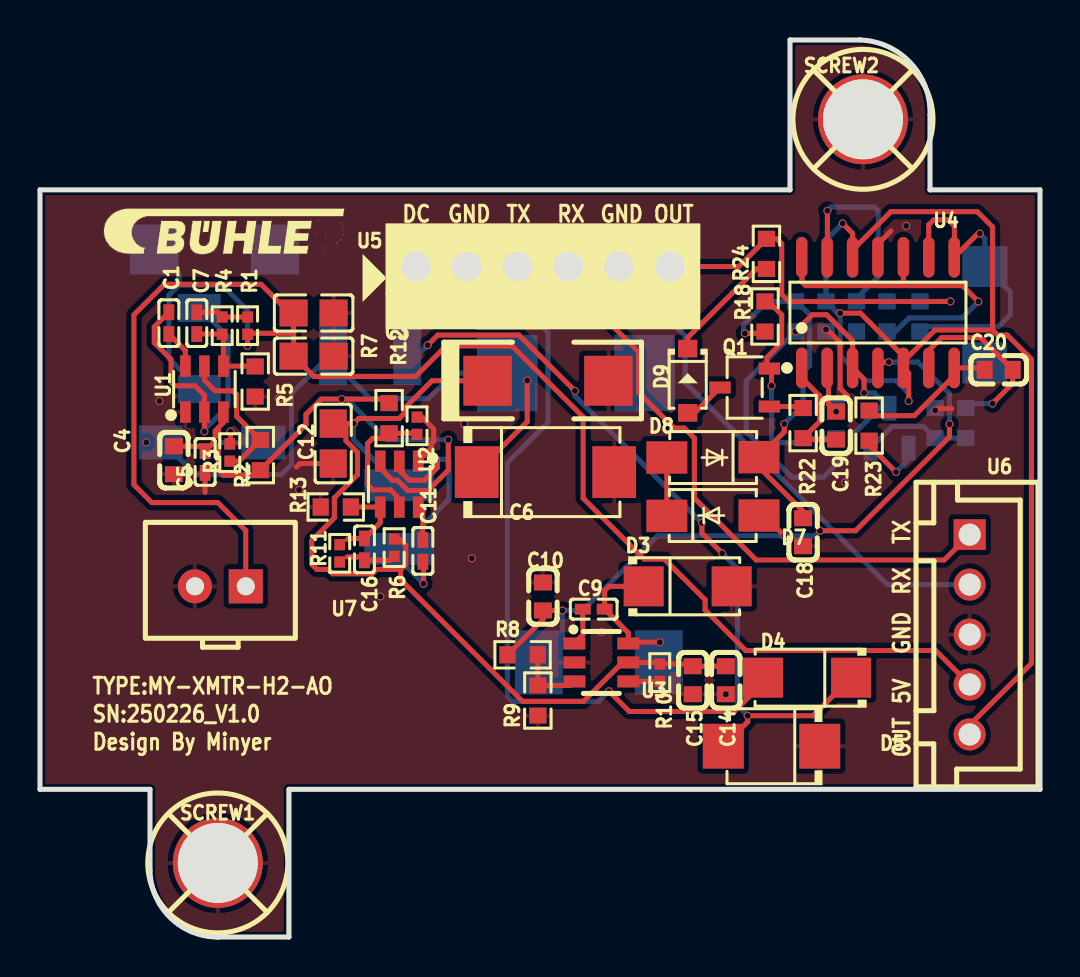
[diagram p3: board, top side]
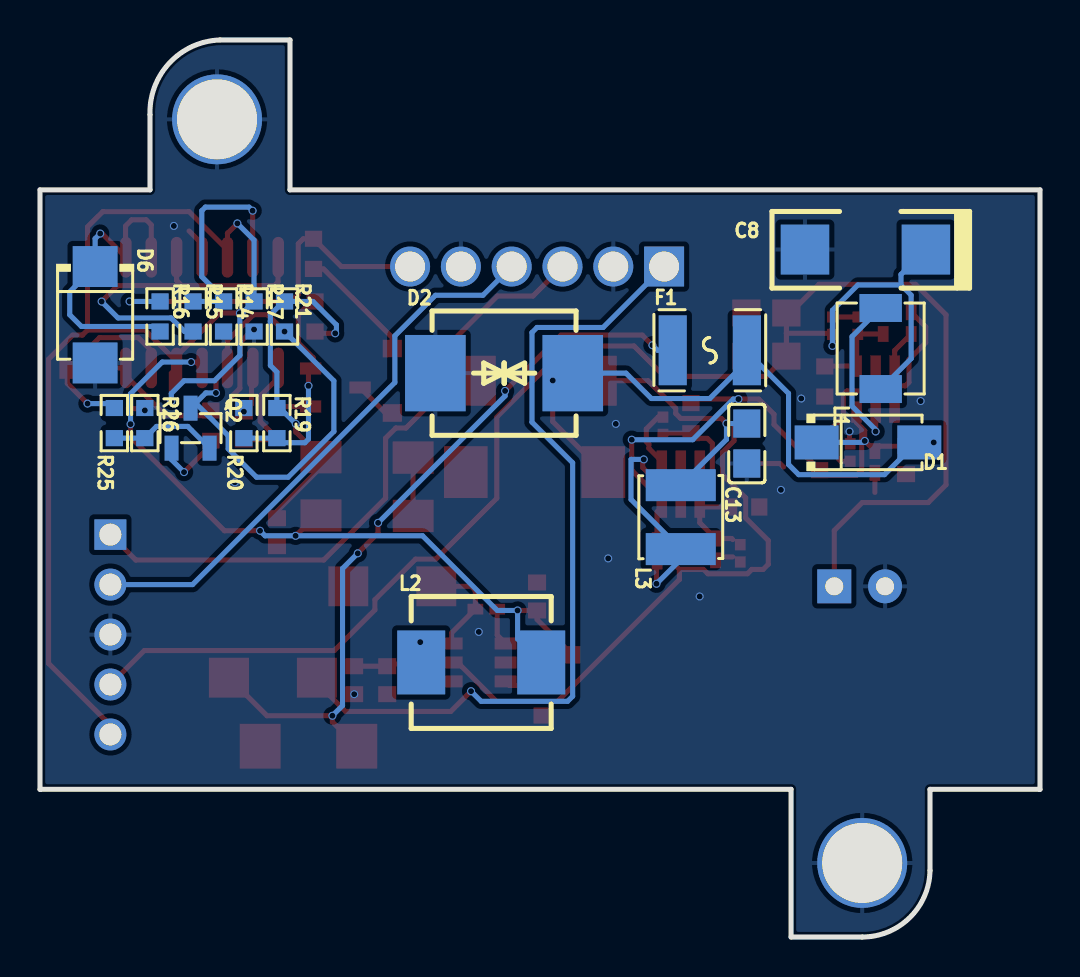
[diagram p4: board, bottom side, seen from below]

Outline 50 x 44.89 mm; copper layers: Top Layer, Bottom Layer. Coordinates in mm from the lower left corner of the outline.
Outline path: 0,7.39 0,37.39 37.5,37.39 37.5,44.89 41,44.89 arc(43.53,43.74) 44.5,41.14 44.5,37.39 50,37.39 50,7.39 12.45,7.39 12.45,0 8.89,0 arc(6.52,0.97) 5.5,3.32 5.5,7.39 0,7.39
Stack: Top Layer 0.035mm / Dielectric1 1.51mm FR4 er 4.5 / Bottom Layer 0.035mm

## Design rules (mm)
template: 自定义配置
spacing copperThickness1oz (default): track to track 0.102, other pairs 0.152 to 0.3
spacing copperThickness2oz: track to track 0.203, other pairs 0.152 to 0.3
track width copperThickness1oz (default): min 0.127, default 0.254, max 2.54
track width copperThickness2oz: min 0.203, default 0.254, max 2.54
differential pair differentialPair (default): width min 0.127, default 0.254, max 2.54; gap min 0.152, default 0.152
via viaSize (default): diameter min 0.254, default 0.508, max 10; hole min 0.127, default 0.254, max 6.299

## Placement (name value [footprint] x y rotation side)
C1  100nF  [C0402]  6.44 30.72 90 top
C2  22uF  [C0805]  13.68 31.23 180 top
C3  22uF  [C0805]  13.68 29.07 180 top
C4  10uF  [C0603]  6.7 23.86 90 top
C5  100nF  [C0402]  8.25 23.77 90 top
C6  47uF  [CAP-SMD_L7.3-W4.3-FD]  25.27 23.27 0 top
C7  75pF  [C0402]  7.84 30.72 90 top
C8  10uF  [CASE-C_6032]  8.73 34.4 180 bottom
C9  100nF  [C0402]  27.69 16.41 180 top
C10  10uF  [C0603]  25.15 17.04 270 top
C11  100nF  [C0402]  19.14 19.32 270 top
C12  22uF  [C0805]  14.66 24.7 90 top
C13  22uF  [C0805]  14.66 24.7 90 bottom
C14  10uF  [C0603]  34.29 12.85 90 top
C15  10uF  [C0603]  32.64 12.85 90 top
C16  100pF  [C0402]  16.22 19.4 270 top
C17  10uF  [CASE-C_6032]  25.4 27.84 180 top
C18  10uF  [C0603]  38.16 20.26 90 top
C19  1nF  [C0603]  39.81 25.59 270 top
C20  1nF  [C0603]  47.93 28.39 0 top
D1  SS14  [SMA_L4.2-W2.6-LS5.3-RD]  8.6 24.75 180 bottom
D2  SMCJ24CAX  [SMC_L6.9-W5.9-LS7.9-BI]  26.8 28.22 180 bottom
D3  SS14  [SMA_L4.3-W2.6-LS5.2-RD]  32.38 17.55 0 top
D4  SS14  [SMA_L4.3-W2.6-LS5.2-RD]  38.35 12.98 180 top
D5  SMBJ36CA  [SMB_L4.6-W3.6-LS5.4-RD]  36.58 9.55 180 top
D6  SMBJ12CA  [SMB_L4.6-W3.6-LS5.4-RD]  47.24 31.14 270 bottom
D7  M7  [SMA_L4.3-W2.6-LS5.0-FD]  33.65 21.08 180 top
D8  M7  [SMA_L4.3-W2.6-LS5.0-FD]  33.65 24 0 top
D9  1N4148W  [SOD-123_L2.7-W1.6-LS3.7-FD]  32.38 27.84 90 top
F1  BSMD1812-050-30V  [F1812]  16.51 29.36 180 bottom
L1  10uH  [IND-SMD_L4.4-W4.2]  7.97 29.45 90 bottom
L2  4.7uH  [IND-SMD_L7.0-W6.6]  27.94 13.74 180 bottom
L3  15uH  [IND-SMD_L4.0-W4.0]  17.96 21.01 90 bottom
Q1  SK2301AA  [SOT-23-3_L2.9-W1.6-P1.90-LS2.8-BR]  35.23 27.5 0 top
Q2  SS8050  [SOT-23-3_L2.9-W1.3-P1.90-LS2.4-BR]  42.47 25.47 270 bottom
R1  49.9Ω  [R0402]  10.38 30.59 270 top
R2  511kΩ  [R0603]  11.01 24.12 270 top
R3  105kΩ  [R0402]  9.49 24.24 270 top
R4  100kΩ  [R0402]  9.11 30.59 90 top
R5  13.3kΩ  [R0603]  10.76 27.8 90 top
R6  49.9Ω  [R0402]  17.71 19.49 90 top
R7  511kΩ  [R0603]  17.45 25.97 90 top
R8  27kΩ  [R0603]  24.13 14.12 0 top
R9  2kΩ  [R0603]  24.89 11.84 90 top
R10  100kΩ  [R0402]  30.99 13.23 90 top
R11  100kΩ  [R0402]  14.99 19.2 270 top
R12  105kΩ  [R0402]  18.85 25.58 270 top
R13  5.23kΩ  [R0603]  14.79 21.52 0 top
R14  10kΩ  [R0603]  40.82 31.05 90 bottom
R15  27kΩ  [R0603]  42.35 31.05 90 bottom
R16  0Ω  [R0603]  44 31.05 90 bottom
R17  100kΩ  [R0603]  39.3 31.05 90 bottom
R18  47Ω  [R0603]  36.25 31.05 90 top
R19  47Ω  [R0603]  38.16 25.72 270 bottom
R20  10kΩ  [R0603]  39.81 25.72 90 bottom
R21  470Ω  [R0603]  37.77 31.05 90 bottom
R22  200Ω  [R0603]  38.16 25.72 90 top
R23  200Ω  [R0603]  41.46 25.59 270 top
R24  0Ω  [R0603]  36.32 34.19 90 top
R25  10kΩ  [R0603]  46.28 25.72 90 bottom
R26  2kΩ  [R0603]  44.76 25.72 270 bottom
SCREW1  -  [M4螺丝]  8.89 3.71 0 top
SCREW2  -  [M4螺丝]  41.15 40.92 0 top
U1  TPS54302DDCR  [SOT-23-6_L2.9-W1.6-P0.95-LS2.8-BL]  8.22 27.42 0 top
U2  TPS54302DDCR  [SOT-23-6_L2.9-W1.6-P0.95-LS2.8-BL]  17.96 22.66 180 top
U3  MP2359DJ-LF-Z  [SOT-23-6_L2.9-W1.6-P0.95-LS2.8-BR]  28.07 13.74 180 top
U4  TP2274-SR  [SOIC-14_L8.7-W3.9-P1.27-LS6.0-BL]  41.9 31.25 0 top
U5  -  [LC8+LZ8V-2.54 5PIN]  18.8 33.55 0 top
U6  ZX-XH2.54-5PZZ  [CONN-TH_5P-P2.50_ZX-XH2.54-5PZZ]  46.48 15.14 270 top
U7  XY-XHB2.54-2A11  [HDR-TH_2P-P2.50-V-F-1]  9.02 17.55 180 top

## Footprints (pads in the part's own frame, mm; a bottom-side part is the same pattern mirrored in y, then rotated)
C0402
  rect 0.79x0.54 smd: 1(-0.545,0) 2(0.545,0)
C0603
  rect 0.8x0.9 smd: 1(-0.7,0) 2(0.7,0)
C0805
  rect 1.41x1.35 smd: 1(-1,0) 2(1,0)
CAP-SMD_L7.3-W4.3-FD
  rect 2.185x2.592 smd: 1(-3.437,0) 2(3.437,0)
CASE-C_6032
  rect 2.425x2.5 smd: 1(3.022,0) 2(-3.022,0)
CONN-TH_5P-P2.50_ZX-XH2.54-5PZZ
  rect 1.524x1.6 hole 1.1: 1(-5,0)
  round 1.6 hole 1.1: 2(-2.5,0) 3(0,0) 4(2.5,0) 5(5,0)
F1812
  rect 1.407x3.499 smd: 1(-1.853,0) 2(1.853,0)
HDR-TH_2P-P2.50-V-F-1
  rect 1.7x1.7 hole 0.9: 1(-1.27,0)
  round 1.7 hole 0.9: 2(1.27,0)
IND-SMD_L4.0-W4.0
  rect 1.6x3.5 smd: 1(-1.6,0) 2(1.6,0)
IND-SMD_L4.4-W4.2
  rect 1.4x2.12 smd: 1(2.028,0) 2(-2.028,0)
IND-SMD_L7.0-W6.6
  rect 2.4x3.2 smd: 1(-3,0) 2(3,0)
LC8+LZ8V-2.54 5PIN
  rect 2x2 hole 1.5: 1(0,0)
  round 2 hole 1.5: 2(2.54,0) 3(5.08,0) 4(7.62,0) 5(10.16,0) 6(12.7,0)
M4螺丝
  round 4.5 hole 4: 1(0,0)
R0402
  rect 0.566x0.54 smd: 1(-0.433,0) 2(0.433,0)
R0603
  rect 0.806x0.864 smd: 1(-0.753,0) 2(0.753,0)
SMA_L4.2-W2.6-LS5.3-RD
  rect 2.2x1.7 smd: 1(-2.566,0) 2(2.566,0)
SMA_L4.3-W2.6-LS5.0-FD
  rect 2.046x1.62 smd: 1(-2.304,-0.009) 2(2.304,0.009)
SMA_L4.3-W2.6-LS5.2-RD
  rect 2x2 smd: 1(-2.2,0) 2(2.2,0)
SMB_L4.6-W3.6-LS5.4-RD
  rect 2.047x2.241 smd: 1(-2.413,0) 2(2.413,0)
SMC_L6.9-W5.9-LS7.9-BI
  rect 3.03x3.82 smd: 1(-3.435,0) 2(3.435,0)
SOD-123_L2.7-W1.6-LS3.7-FD
  rect 0.88x0.96 smd: 1(-1.61,0) 2(1.61,0)
SOIC-14_L8.7-W3.9-P1.27-LS6.0-BL
  oval 0.574x2.038 smd: 1(-3.81,-2.769) 2(-2.54,-2.769) 3(-1.27,-2.769) 4(0,-2.769) 5(1.27,-2.769) 6(2.54,-2.769) 7(3.81,-2.769) 8(3.81,2.769) 9(2.54,2.769) 10(1.27,2.769) 11(0,2.769) 12(-1.27,2.769) 13(-2.54,2.769) 14(-3.81,2.769)
SOT-23-3_L2.9-W1.3-P1.90-LS2.4-BR
  rect 1.25x0.7 smd: 1(1,-0.95) 2(1,0.95) 3(-1,0)
SOT-23-3_L2.9-W1.6-P1.90-LS2.8-BR
  rect 1.07x0.6 smd: 1(1.235,-0.95) 2(1.235,0.95) 3(-1.235,0)
SOT-23-6_L2.9-W1.6-P0.95-LS2.8-BL
  rect 0.532x1.072 smd: 1(-0.95,-1.149) 2(0,-1.149) 3(0.95,-1.149) 4(0.95,1.149) 5(0,1.149) 6(-0.95,1.149)
SOT-23-6_L2.9-W1.6-P0.95-LS2.8-BR
  rect 1.1x0.6 smd: 1(1.35,-0.95) 2(1.35,0) 3(1.35,0.95) 4(-1.35,0.95) 5(-1.35,0) 6(-1.35,-0.95)

## Nets
As in the schematic.

## Via types
v1: diameter 0.4, hole 0.3, Top Layer to Bottom Layer, 50 vias

## Routing (per net, layer and track width the routed paths; a pad name or vN(x,y) marks a point on that pad's centre or on a via; arc(x,y) is an arc through that point)
5V: length 90.7
  Top Layer w0.254: v1(10.38,29.58) R1.2 10.43,30.21 12.68,30.21 ; U6.4 44.78,14.34 35.29,14.34 33.25,16.37 33.25,16.88 31.22,18.91 30.21,18.91 27.16,21.96 27.16,26.02 23.6,29.58 20.3,29.58 18.78,28.05 13.7,28.05 C3.2 12.68,30.21 ; 12.68,30.21 C2.2 12.48,31.23 11.05,32.66 6.22,32.66 4.7,31.14 4.7,22.63 5.59,21.74 8.89,21.74 10.29,20.34 U7.1
  Bottom Layer w0.254: 6.95,32.63 6.44,32.12 6.44,28.95 L1.2 ; 6.95,32.63 9.11,32.63 10.38,31.36 v1(10.38,29.58) ; 6.95,32.63 6.95,33.16 C8.1
12V: length 49
  Top Layer w0.254: C17.1 19.6,27.84 18.22,26.46 18.22,26.2 17.96,25.95 15.93,25.95 v1(15.68,25.7) 15.3,25.7 ; R6.2 17.96,19.92 18.28,19.6 18.28,18.65 18.03,18.4 ; 15.3,25.7 15.3,24.84 15.88,24.26 15.88,23.13 14.72,21.98 14.72,20.97 13.59,19.84 13.59,18.65 13.84,18.4 14.41,18.4 14.63,18.18 16.61,18.18 16.83,18.4 18.03,18.4 ; 15.3,25.7 C12.2 ; C14.2 C15.2 32.53,13.67 R10.2 30.91,13.74 U3.5 29.12,13.74 27.17,11.79 24.13,11.79 18.03,17.89 18.03,18.4
  Bottom Layer w0.254: L3.2 15.68,24.9 v1(15.68,25.7) C12.2
GND: length 12.7
  Top Layer w0.254: v1(9.53,25.3) 9.53,24.71 R3.1 ; 42.54,35.33 41.9,34.68 U4.11 ; 39.43,30.31 40,29.74 40,27.46 40.39,27.08 ; U2.1 19.56,24.46 19.56,24.66 19.69,24.79 19.69,25.42 19.09,26.02 R12.1 ; C12.1 13,23.7 12.83,23.52 ; v1(44.76,26.35) 44.85,26.44 45.59,26.44 ; C5.1 8.25,22.25
  Bottom Layer w0.254: R26.1 v1(44.76,26.35)
  vias: v1(5.97,26.82) v1(11.94,26.95) v1(12.95,22.38) v1(17.02,17.04) v1(21.21,25.68) v1(21.59,18.95) v1(28.06,15.27) v1(34.29,12.15) v1(39.3,30.4) v1(40.26,22.76) v1(43.31,35.58)
VCC: length 31.5
  Top Layer w0.254: v1(20.41,24.89) 20.41,23.36 19.4,22.35 18.38,22.35 17.87,22.86 17.62,22.86 17.11,23.36 17.11,23.71 U2.3 ; R7.2 17.25,26.92 v1(15.08,26.92) 14.06,26.92 13.3,26.16 13.3,25.65 R2.2 10.76,23.11 9.17,23.11 8.92,23.36 8.92,25.49 ; U1.3 9.17,25.74 8.92,25.49 ; C4.2 8.01,24.56 C5.2 v1(8.76,24.83) 8.76,25.33 8.92,25.49
  Bottom Layer w0.254: v1(15.08,26.92) 15.33,26.92 17.36,24.89 v1(20.41,24.89) ; v1(8.76,24.83) 8.84,24.75 D1.1
VDD: length 38.2
  Top Layer w0.254: U4.4 42.19,28.77 v1(42.44,28.77) ; v1(39,20.33) 40.78,20.33 45.47,25.03 v1(45.47,25.67) ; D7.1 36.2,21.09 v1(37.22,20.08) ; R8.1 25.15,15.89 C10.2 v1(26.12,16.34)
  Bottom Layer w0.254: v1(42.44,28.77) 43.89,28.77 45.47,27.19 v1(45.47,25.67) ; v1(39,20.33) 38.74,20.08 v1(37.22,20.08) 30.87,20.08 27.14,16.34 v1(26.12,16.34) 26.12,14.92 L2.2
DC24V: length 37.7
  Top Layer w0.254: v1(34.11,19.2) 33.1,20.22 v1(33.1,20.73) ; v1(19.38,29.62) 19.89,30.12 23.95,30.12 v1(26.75,27.33) ; 34.16,9.55 35.38,10.77 v1(35.38,11.07) 38.65,11.07 D4.1
  Bottom Layer w0.254: F1.1 19.13,29.36 v1(19.38,29.62) ; v1(34.11,19.2) 34.87,18.44 34.87,11.58 v1(35.38,11.07) ; v1(26.75,27.33) 26.75,27.08 v1(33.1,20.73)
RXD: length 28
  Bottom Layer w0.254: U5.4 27.85,32.12 30.23,32.12 32.26,30.08 32.26,27.75 42.37,17.64 U6.2
TXD: length 32.2
  Top Layer w0.254: U6.1 45.21,18.87 35.81,18.87 32.72,21.96 32.72,24.96 32.21,25.47 31.7,25.47 29.93,27.25 29.93,29.28 27.13,32.08 25.35,32.08 U5.3
U4.1: length 5.9
  Top Layer w0.254: C19.2 38.23,24.89 R22.1 38.99,25.8 38.99,27.08 38.09,27.98 U4.1
U4.2: length 2.4
  Top Layer w0.254: U4.2 39.36,27.97 39.43,27.9 39.43,26.67 v1(39.81,26.29)
U4.3: length 24
  Top Layer w0.254: v1(41.2,27.23) 41.2,27.9 U4.3 40.63,29.84 39.33,31.14 38.61,31.14 v1(37.77,30.3)
  Bottom Layer w0.254: 42.22,26.72 41.71,27.23 v1(41.2,27.23) ; 42.22,26.72 40.59,25.09 40.59,24.43 39.17,23.01 37.59,23.01 35.31,25.3 35.31,27.83 v1(37.77,30.3) ; 42.22,26.72 Q2.3
U4.6: length 9.5
  Top Layer w0.254: U4.6 44.44,29.35 45.09,30 47.02,30 C20.2 48.63,27.7 v1(47.62,26.69)
  Bottom Layer w0.254: v1(47.62,26.69) 46.51,26.69 R25.2
U4.7: length 7.1
  Top Layer w0.254: R23.1 41.71,26.09 43.72,26.09 45.71,28.08 U4.7 47.14,28.48 C20.1
U4.9: length 15.8
  Top Layer w0.254: v1(46.99,35.2) 46.89,35.2 45.85,34.16 45.72,34.28 45.72,35.58 45.41,35.89 44.69,35.89 44.44,35.64 U4.9
  Bottom Layer w0.254: R16.1 44.25,30.55 47.93,30.55 48.51,31.14 48.51,32.28 D6.1 47.24,34.95 v1(46.99,35.2)
U4.10: length 17.2
  Top Layer w0.254: 42.91,32.6 46.12,32.6 v1(46.92,31.8) ; 42.91,32.6 38.28,32.6 38.1,32.78 38.1,34 U4.14 ; 42.91,32.6 43.17,32.85 U4.10
  Bottom Layer w0.254: R15.1 42.77,30.3 43.45,30.98 46.1,30.98 v1(46.92,31.8)
U4.12: length 61.2
  Top Layer w0.254: v1(43.43,26.82) 43.43,28.21 U4.5 43.31,28.62 43.31,28.93 ; 43.31,28.93 41.02,31.22 v1(40,31.22) ; 43.31,28.93 44.75,30.38 47.62,30.38 ; 47.62,30.38 47.62,35.54 46.86,36.3 42.54,36.3 40.63,34.38 ; 47.62,30.38 47.88,30.12 48.37,30.12 49.57,28.92 49.57,13.69 46.74,10.86 46.74,10.52 46.35,10.14 ; 40.63,34.38 40.63,35.22 v1(40.13,35.71) ; 40.63,34.38 U4.12
  Bottom Layer w0.254: v1(40,31.22) 39.88,31.22 ; 39.88,31.22 40.01,31.09 40.01,29.78 40,29.78 40,29.11 41.28,27.84 42.8,27.84 43.43,27.2 v1(43.43,26.82) ; 39.88,31.22 R17.2 39.3,34.88 v1(40.13,35.71)
U4.13: length 11.5
  Top Layer w0.254: U4.13 39.37,34.03 v1(39.37,36.35)
  Bottom Layer w0.254: R15.2 R14.2 40.82,31.96 41.91,33.04 41.91,36.35 41.73,36.53 39.55,36.53 v1(39.37,36.35)
$1N943: length 29.9
  Top Layer w0.254: C6.1 24.36,25.79 v1(24.36,27.85)
  Bottom Layer w0.254: D1.2 6.16,24.75 7.78,23.14 12.06,23.14 12.57,23.65 12.57,27.2 14.17,28.8 14.66,28.8 ; D2.2 20.7,28.22 19.43,26.95 16.51,26.95 14.66,28.8 ; 14.66,28.8 F1.2
  vias: v1(5.31,24.75)
$1N949: length 7.3
  Top Layer w0.254: R3.2 9.96,23.81 R2.1 9.83,26.05 9.83,27.15 9.65,27.33 8.76,27.33 8.22,27.87 U1.5
$1N950: length 2
  Top Layer w0.254: U1.6 7.27,29.35 C1.1
$1N951: length 15.1
  Top Layer w0.254: v1(8.22,25.3) U1.2 8.22,27.11 7.75,27.58 6.73,27.58 6.55,27.76 6.55,28.91 5.72,29.74 5.72,30.54 C1.2
  Bottom Layer w0.254: 8.25,25.3 8.25,25.42 9.4,26.57 9.4,30.05 L1.1
$1N954: length 2.6
  Top Layer w0.254: C7.2 8.87,31.27 R4.2 R1.1
$1N955: length 4.5
  Top Layer w0.254: R5.2 10.75,28.57 U1.4 9.17,30.1 R4.1 9.09,30.18 C7.1
$1N1502: length 7.1
  Top Layer w0.254: U2.5 17.84,21.64 17.84,22.07 17.53,22.38 16.64,22.38 16.38,22.63 16.38,24.7 16.64,24.96 17.2,24.96 R7.1 18.79,25.21 R12.2
$1N1503: length 1.7
  Top Layer w0.254: U2.6 19.14,21.28 C11.1
$1N1504: length 12.8
  Top Layer w0.254: v1(19.18,17.68) 19.18,18.74 C11.2 ; v1(19.81,23.9) 19.86,23.85 19.86,23.49 19.23,22.86 18.46,22.86 18.01,23.31 18.01,23.76 U2.2
  Bottom Layer w0.254: v1(19.18,17.68) 17.96,18.89 L3.1 20.45,21.9 20.45,23.9 v1(19.81,23.9)
$1N1507: length 2.5
  Top Layer w0.254: 15.37,19.02 16.05,19.02 C16.2 17.51,18.85 R6.1
$1N1508: length 4.2
  Top Layer w0.254: R13.2 17.01,21.52 U2.4 17.01,20.73 C16.1 15.42,19.94 15.37,19.89
$1N1920: length 6.8
  Top Layer w0.254: D3.1 28.45,17.55 28.23,17.33 C9.1 29.42,15.22 U3.6 29.48,14.76 v1(30.99,14.76)
$1N2087: length 1.6
  Top Layer w0.254: U3.4 30.98,12.79 R10.1
$1N2108: length 1.9
  Top Layer w0.254: 27.14,16.41 27.14,15.11 U3.1
$1N2261: length 3.4
  Top Layer w0.254: R8.2 24.89,14.11 R9.2 26.52,12.59 U3.3
$2N857: length 3.6
  Top Layer w0.254: R23.2 41.46,24.61 v1(42.8,23.27)
  Bottom Layer w0.254: Q2.1 43.42,23.89 v1(42.8,23.27)
$2N979: length 17.8
  Top Layer w0.254: v1(37.21,25.68) 37.21,25.27 D8.2 35.95,23.51 38.16,21.31 C18.2 ; R18.1 36.16,30.21 v1(35.24,30.21)
  Bottom Layer w0.254: v1(35.24,30.21) 35.18,30.27 35.18,30.63 36.35,31.81 R21.2 37.81,31.81 38.48,31.14 38.48,30.82 38.49,30.82 38.49,29.78 38.48,29.78 38.48,28.6 38.16,28.27 R19.1 38,26.47 v1(37.21,25.68)
$2N983: length 11.1
  Top Layer w0.254: v1(36.58,27.58) 36.58,28.34 Q1.2 36.34,28.57 36.34,29 37.08,29.74 37.08,31.14 36.42,31.81 R18.2
  Bottom Layer w0.254: v1(36.58,27.58) 36.58,24.92 36.76,24.74 37.93,24.74 R19.2 R20.1
$2N1088: length 2.9
  Top Layer w0.254: 31.34,21.07 31.34,24
$2N1306: length 5.5
  Bottom Layer w0.254: Q2.2 42.61,25.55 44.17,25.55 R26.2 R25.1
$2N1462: length 1.7
  Top Layer w0.254: R22.2 38.08,26.55 Q1.1
$2N1508: length 2.1
  Top Layer w0.254: D9.1 32.73,26.23 Q1.3
$2N2130: length 5.9
  Top Layer w0.254: D9.2 32.38,30 35.82,33.43 R24.1
$2N2230: length 41.4
  Top Layer w0.254: v1(28.45,12.3) 29.46,11.29 34.72,11.29 36.15,12.72 D4.2
  Bottom Layer w0.254: v1(28.45,12.3) 27.94,11.79 23.62,11.79 23.37,12.05 23.37,23.73 25.4,25.76 25.4,30.25 25.15,30.5 21.84,30.5 U5.1
$2N2492: length 18.9
  Top Layer w0.254: v1(45.52,31.81) 37.43,31.81 37.08,32.16 37.08,34.7 36.84,34.94 R24.2 34.93,33.55 U5.6
  Bottom Layer w0.254: v1(45.52,31.81) R16.2

## Copper pours and planes (outline as drawn; the poured copper is in the pictures)
GND on Top Layer: 0.13,45.11 52.96,45.11 53.47,44.6 53.47,2.44 50.67,-0.36 -0.19,-0.36 -0.55,0 -0.55,44.44
GND on Bottom Layer: 0,45.62 52.2,45.62 52.58,46 52.58,-1.12 51.56,-2.13 -2.92,-2.13 0,0.79

## Text on the board
Top Silkscreen Layer: TYPE:MY-XMTR-H2-AO | SN:250226_V1.0 | Design By Minyer | DC | GND | TX | RX | OUT | 5V

# Board PCB2
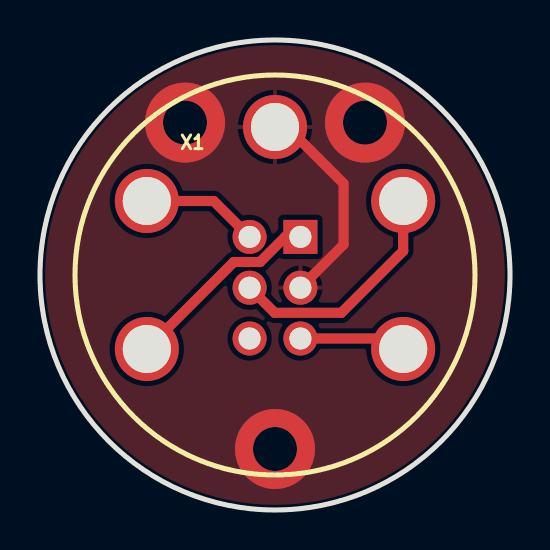
[diagram p5: board, top side]
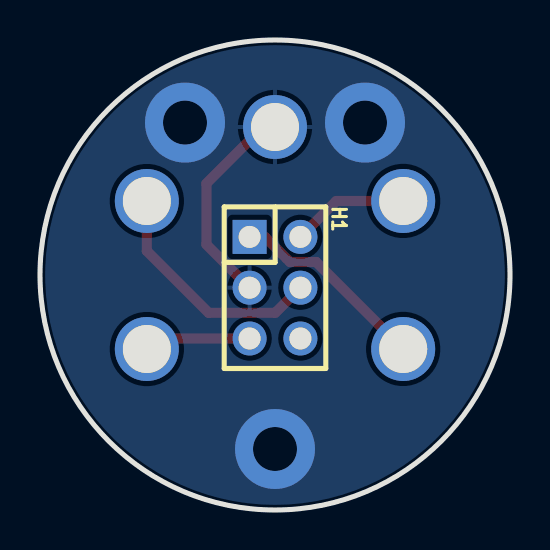
[diagram p6: board, bottom side, seen from below]

Outline 23.5 x 23.5 mm; copper layers: Top Layer, Bottom Layer. Coordinates in mm from the lower left corner of the outline.
Outline path: circle c11.75,11.75 r11.75
Stack: Top Layer 0.035mm / Dielectric1 1.51mm FR4 er 4.5 / Bottom Layer 0.035mm

## Design rules (mm)
template: JLCPCB Capability(Two Layers Board)
spacing copperThickness1oz (default): track to track 0.102, other pairs 0.152 to 0.3
spacing copperThickness2oz: track to track 0.203, other pairs 0.152 to 0.3
track width copperThickness1oz (default): min 0.127, default 0.254, max 2.54
track width copperThickness2oz: min 0.203, default 0.254, max 2.54
differential pair differentialPair (default): width min 0.127, default 0.254, max 2.54; gap min 0.152, default 0.152
via viaSize (default): diameter min 0.5, default 0.61, max 10; hole min 0.3, default 0.305, max 6.3

## Placement (name value [footprint] x y rotation side)
H1  PZ254V-12-6P  [HDR-TH_6P-P2.54-V-M-R2-C3-S2.54]  11.75 11.11 270 bottom
X1  -  [氢气传感器连接器]  11.75 11.75 0 top

## Footprints (pads in the part's own frame, mm; a bottom-side part is the same pattern mirrored in y, then rotated)
HDR-TH_6P-P2.54-V-M-R2-C3-S2.54
  rect 1.7x1.7 hole 1.1: 1(-2.54,-1.27)
  round 1.7 hole 1.1: 2(-2.54,1.27) 3(0,-1.27) 4(0,1.27) 5(2.54,-1.27) 6(2.54,1.27)
氢气传感器连接器
  round 3.2 hole 2.4: 1(-6.409,-3.7) 2(-6.409,3.7) 3(0,7.4) 4(6.409,3.7) 5(6.409,-3.7)

## Nets
As in the schematic.

Pads without a net: H1 6

## Via types
v1: diameter 4, hole 2.2, Top Layer to Bottom Layer, 3 vias

## Routing (per net, layer and track width the routed paths; a pad name or vN(x,y) marks a point on that pad's centre or on a via; arc(x,y) is an arc through that point)
5V: length 5.9
  Top Layer w0.508: X1.2 8.69,15.45 H1.2
GND: length 10.7
  Top Layer w0.508: X1.3 12.35,19.15 15.18,16.32 15.18,13.27 H1.3
  vias: v1(7.25,19.37) v1(11.75,3.05) v1(16.25,19.37)
RXD: length 12
  Top Layer w0.508: H1.4 11.74,9.86 15.07,9.86 18.16,12.95 X1.4
TXD: length 5.4
  Top Layer w0.508: H1.5 17.63,8.58 X1.5
$1N305: length 10
  Top Layer w0.508: H1.1 12.26,13.66 11,12.4 9.69,12.4 X1.1

## Copper pours and planes (outline as drawn; the poured copper is in the pictures)
GND on Top Layer: -5.14,26.1 24.7,26.1 24.7,-1.58 -5.14,-1.58
GND on Bottom Layer: -8.95,26.74 27.12,26.74 27.12,-3.24 -8.95,-3.24
